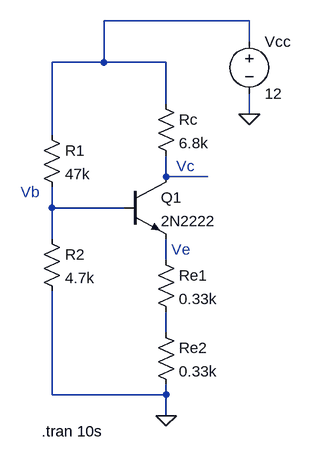
[diagram p0: schematic Exp 04 measurement of DC.asc]
Exp 04 measurement of DC.asc, the LTspice schematic file:
Version 4
SHEET 1 880 680
WIRE 480 -128 256 -128
WIRE 480 -96 480 -128
WIRE 256 -64 256 -128
WIRE 256 -64 176 -64
WIRE 352 -64 256 -64
WIRE 352 0 352 -64
WIRE 480 16 480 -16
WIRE 176 48 176 -64
WIRE 352 112 352 80
WIRE 416 112 352 112
WIRE 176 160 176 128
WIRE 288 160 176 160
WIRE 176 208 176 160
WIRE 352 240 352 208
WIRE 352 352 352 320
WIRE 176 448 176 288
WIRE 352 448 352 432
WIRE 352 448 176 448
WIRE 352 480 352 448
FLAG 352 480 0
FLAG 480 16 0
SYMBOL res 160 32 R0
SYMATTR InstName R1
SYMATTR Value 47k
SYMBOL res 160 192 R0
SYMATTR InstName R2
SYMATTR Value 4.7k
SYMBOL npn 288 112 R0
SYMATTR InstName Q1
SYMATTR Value 2N2222
SYMBOL res 336 224 R0
SYMATTR InstName Re1
SYMATTR Value 0.33k
SYMBOL res 336 336 R0
SYMATTR InstName Re2
SYMATTR Value 0.33k
SYMBOL res 336 -16 R0
SYMATTR InstName Rc
SYMATTR Value 6.8k
SYMBOL voltage 480 -112 R0
WINDOW 123 0 0 Left 0
WINDOW 39 0 0 Left 0
SYMATTR InstName Vcc
SYMATTR Value 12
TEXT 160 504 Left 2 !.tran 10s
TEXT 128 136 Left 2 ;Vb
TEXT 368 96 Left 2 ;Vc
TEXT 360 224 Left 2 ;Ve

The netlist it stands for:
* Exp 04 measurement of DC.asc
R1 N001 N003 47k
R2 N003 0 4.7k
Q1 N002 N003 N004 0 2N2222
Re1 N004 N005 0.33k
Re2 N005 0 0.33k
Rc N001 N002 6.8k
Vcc N001 0 12
.model NPN NPN
.model PNP PNP
.lib standard.bjt
.tran 10s
* Vb
* Vc
* Ve
.backanno
.end